# Altium schematic sheet Sheet1.SchDoc
size A3
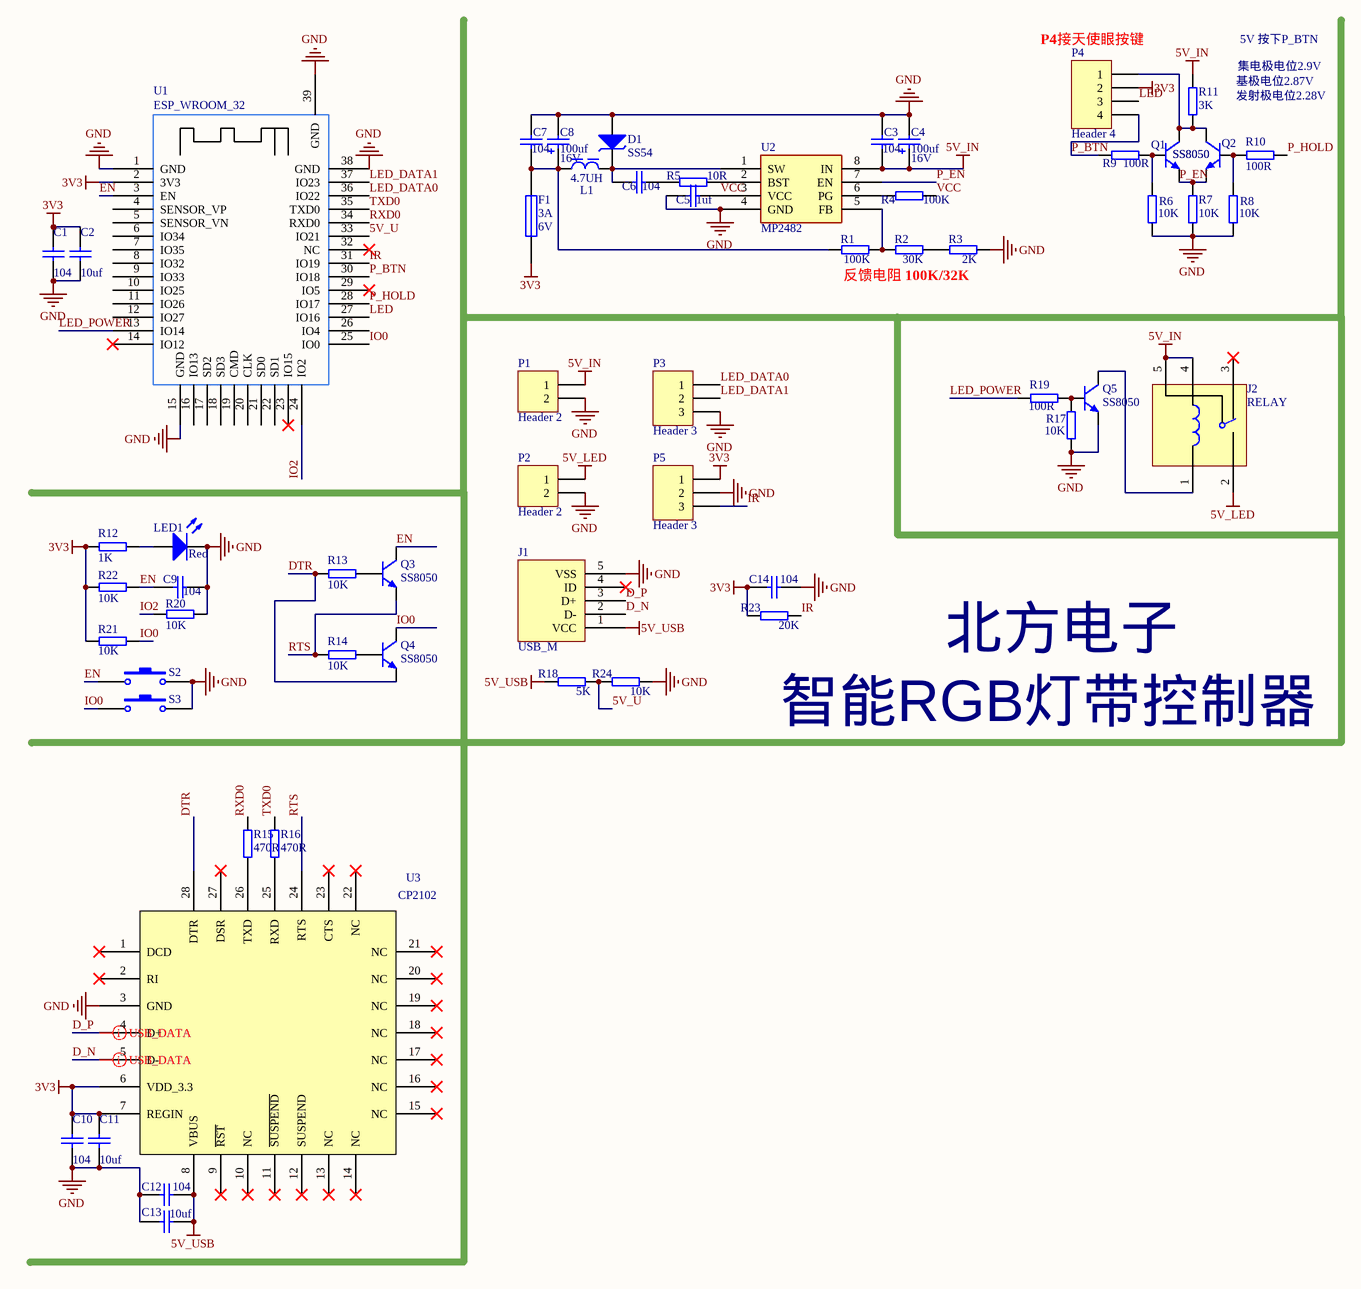
[diagram p0: Sheet1.SchDoc]

## Parts
C1  104  [CAPC1005[0402]S]
C2  10uf  [CAPC1005[0402]S]
C3  104  [CAPC1005[0402]S]
C4  Voltage: 16V  [CAPT6032]  (hidden comment: 100uf)
C5  1uf  [CAPC1005[0402]S]
C6  104  [CAPC1005[0402]S]
C7  104  [CAPC1005[0402]S]
C8  Voltage: 16V  [CAPT6032]  (hidden comment: 100uf)
C9  104  [CAPC1005[0402]S]
C10  104  [CAPC1005[0402]S]
C11  10uf  [CAPC1005[0402]S]
C12  104  [CAPC1005[0402]S]
C13  10uf  [CAPC1005[0402]S]
C14  104  [CAPC1005[0402]S]
D1  SS54  [SMA[DO-214AC]]
F1  Imax: 3A  Voltage: 6V  [CAPC4532[1812]S]
J1  USB_M  [1__Micro USB 牛角]
J2  RELAY  [RELAY-HK3FF]
L1  4.7UH  [CD75]
LED1  Red  [LEDC1608(0603)]
P1  Header 2  [DC-5.5mm]
P2  Header 2  [KF142R_2P]
P3  Header 3  [HDR1X3]
P4  Header 4  [HDR1X4]
P5  Header 3  [HDR1X3]
Q1  SS8050  [SOT23]
Q2  SS8050  [SOT23]
Q3  SS8050  [SOT23]
Q4  SS8050  [SOT23]
Q5  SS8050  [SOT23]
R1  100K  [RESC1005[0402]S]
R2  30K  [RESC1005[0402]S]
R3  2K  [RESC1005[0402]S]
R4  100K  [RESC1005[0402]S]
R5  10R  [RESC1005[0402]S]
R6  10K  [RESC1005[0402]S]
R7  10K  [RESC1005[0402]S]
R8  10K  [RESC1005[0402]S]
R9  100R  [RESC1005[0402]S]
R10  100R  [RESC1005[0402]S]
R11  3K  [RESC1005[0402]S]
R12  1K  [RESC1005[0402]S]
R13  10K  [RESC1005[0402]S]
R14  10K  [RESC1005[0402]S]
R15  470R  [RESC1005[0402]S]
R16  470R  [RESC1005[0402]S]
R17  10K  [RESC1005[0402]S]
R18  5K  [RESC1005[0402]S]
R19  100R  [RESC1005[0402]S]
R20  10K  [RESC1005[0402]S]
R21  10K  [RESC1005[0402]S]
R22  10K  [RESC1005[0402]S]
R23  20K  [RESC1005[0402]S]
R24  10K  [RESC1005[0402]S]
S2  SW-PB  [button]  (value not drawn)
S3  SW-PB  [button]  (value not drawn)
U1  ESP_WROOM_32  [ESP32]
U2  MP2482  [SOIC-8]
U3  CP2102  [QFN_28]

## Nets
3V3: C1.2 C2.2 C10.2 C11.2 C14.1 F1.1 P4.2 P5.1 R12.1 R21.1 R22.1 R23.2 U1.2(3V3) U3.6(VDD_3.3) U3.7(REGIN)
5V_IN: C3.1 C4.1 J2.4 J2.5 P1.1 R11.1 U2.8(IN)
5V_LED: J2.2 P2.1
5V_USB: C12.2 C13.2 J1.1(VCC) R18.2 U3.8(VBUS)
GND: C1.1 C2.1 C3.2 C4.2 C5.2 C7.2 C8.2 C9.1 C10.1 C11.1 C12.1 C13.1 C14.2 D1.A J1.5(VSS) LED1.C P1.2 P2.2 P3.3 P5.2 Q5.2(E) R3.1 R6.1 R7.1 R8.1 R17.2 R20.2 R24.1 S2.2 S3.2 U1.1(GND) U1.15(GND) U1.38(GND) U1.39(GND) U2.4(GND) U3.3(GND)
5V_U: R18.1 R24.2 U1.33(IO21)
D_N: J1.2(D-) U3.5(D-)
D_P: J1.3(D+) U3.4(D+)
DTR: Q4.2(E) R13.2 U3.28(DTR)
EN: C9.2 Q3.3(C) R22.2 S2.1 U1.3(EN)
IO0: Q4.3(C) R21.2 S3.1 U1.25(IO0)
IO2: R20.1 U1.24(IO2)
IR: P5.3 R23.1 U1.31(IO19)
LED: P4.3 U1.27(IO16)
LED_DATA0: P3.1 U1.36(IO22)
LED_DATA1: P3.2 U1.37(IO23)
LED_POWER: R19.1 U1.13(IO14)
P_BTN: P4.4 R9.2 U1.30(IO18)
P_EN: Q1.2(E) Q2.2(E) R7.2 U2.7(EN)
P_HOLD: R10.1 U1.28(IO17)
RTS: Q3.2(E) R14.2 U3.24(RTS)
RXD0: R15.1 U1.34(RXD0)
TXD0: R16.1 U1.35(TXD0)
VCC: C5.1 R4.1 U2.3(VCC)
NetC6_1: C6.1 R5.2
NetC6_2: C6.2 D1.K L1.2 U2.1(SW)
NetC7_1: C7.1 C8.1 F1.2 L1.1 R1.2
NetJ2_1: J2.1 Q5.3(C)
NetLED1_A: LED1.A R12.2
NetP4_1: P4.1 Q1.3(C) Q2.3(C) R11.2
NetQ1_1: Q1.1(B) R6.2 R9.1
NetQ2_1: Q2.1(B) R8.2 R10.2
NetQ3_1: Q3.1(B) R13.1
NetQ4_1: Q4.1(B) R14.1
NetQ5_1: Q5.1(B) R17.1 R19.2
NetR1_1: R1.1 R2.2 U2.5(FB)
NetR2_1: R2.1 R3.2
NetR4_2: R4.2 U2.6(PG)
NetR5_1: R5.1 U2.2(BST)
NetR15_2: R15.2 U3.26(TXD)
NetR16_2: R16.2 U3.25(RXD)

Not connected (* = marked no-connect by the designer): J1 4(ID)*; J2 3*; U1 4(SENSOR_VP) 5(SENSOR_VN) 6(IO34) 7(IO35) 8(IO32) 9(IO33) 10(IO25) 11(IO26) 12(IO27) 14(IO12)* 16(IO13) 17(SD2) 18(SD3) 19(CMD) 20(CLK) 21(SD0) 22(SD1) 23(IO15)* 26(IO4) 29(IO5)* 32(NC)*; U3 1(DCD)* 2(RI)* 9(~{RST})* 10(NC)* 11(~{SUSPEND})* 12(SUSPEND)* 13(NC)* 14(NC)* 15(NC)* 16(NC)* 17(NC)* 18(NC)* 19(NC)* 20(NC)* 21(NC)* 22(NC)* 23(CTS)* 27(DSR)*

## Layout directives
differential pair: D_N, D_P

## Notes on the sheet
- (near P4) P4接天使眼按键
- 基极电位2.87V
- 发射极电位2.28V
- 集电极电位2.9V
- 5V 按下P_BTN
- 反馈电阻 100K/32K
- 北方电子
- 智能RGB灯带控制器

## Library data of the parts
C1-C3 C5-C7 C9-C14 = Cap Chip 2: Chip Capacitor, Silkscreen Border; Voltage: 63V; Tolerance: Y5V; Published: 8-Jun-2000; Revision: July-2002: Re-released for DXP Platform.; Publisher: Altium Limited; Price(RMB): 0.000
  C1 C3 C6 C7 C9 C10 C12 C14: Value: 104
  C2 C11 C13: Value: 10uf
  C5: Value: 1uf
C4 C8 = Cap Tan: Molded (Tantalum) Capacitor, 2-Leads,; Published: 8-Jun-2000; Revision: July-2002: Re-released for DXP Platform.; Publisher: Altium Limited; Price(RMB): 0.000; Value: 100uf
D1 = Diode TVS Uni-Dir: TRANSIENT VOLTAGE  SUPPRESSOR DIODE; Imax: 500mA; Published: 8-Jun-2000; Publisher: Altium Limited; Price(RMB): 0.000; PartNumber: SS54
F1 = Fuse Chip: Fuse; Published: 8-Jun-2000; Revision: July-2002: Re-released for DXP Platform.; Publisher: Altium Limited; Price(RMB): 0.000
J1 = USB_M: MicroUSB接口
J2 = RELAY-HK3FF: 单刀双掷继电器
L1 = Ind Power: Power Inductor, Ferrite-Core; Imax: 50mA; DCR: .5m; Published: 8-Jun-2000; Revision: July-2002: Re-released for DXP Platform.; Publisher: Altium Limited; Price(RMB): 0.000; Value: 4.7UH
LED1 = LED Chip: Typical Chip LED; Published: 8-Jun-2000; Revision: July-2002: Re-released for DXP Platform.; Publisher: Altium Limited; Price(RMB): 0.00; Color: Red
P1 P2 = Header 2: Header, 2-Pin; LatestRevisionDate: 17-Jul-2002; LatestRevisionNote: Re-released for DXP Platform.; Publisher: Altium Limited; Price(RMB): 0.00
P3 P5 = Header 3: Header, 3-Pin; LatestRevisionDate: 17-Jul-2002; LatestRevisionNote: Re-released for DXP Platform.; Publisher: Altium Limited; Price(RMB): 0.00
P4 = Header 4: Header, 4-Pin; LatestRevisionDate: 17-Jul-2002; LatestRevisionNote: Re-released for DXP Platform.; Publisher: Altium Limited; Price(RMB): 0.00
Q1-Q5 = NPN SMC SOT-23: NPN Bipolar Transistor; Published: 8-Jun-2000; Revision: July-2002: Re-released for DXP Platform.; Publisher: Altium Limited; Price(RMB): 0.000; PartNumber: SS8050
R1-R24 = Res Chip 2p 2: Chip Resistor, Border Silkscreen On PCB Library; Tolerance: 5%; Published: 8-Jun-2000; Revision: July-2002: Re-released for DXP Platform.; Publisher: Altium Limited; Price(RMB): 0.000
  R1 R4: Value: 100K
  R2: Value: 30K
  R3: Value: 2K
  R5: Value: 10R
  R6-R8 R13 R14 R17 R20-R22 R24: Value: 10K
  R9 R10 R19: Value: 100R
  R11: Value: 3K
  R12: Value: 1K
  R15 R16: Value: 470R
  R18: Value: 5K
  R23: Value: 20K
S2 S3 = SW-PB: Switch; Published: 24-Mar-1999; Revision: July-2002: Re-released for DXP Platform.; Publisher: Altium Limited; Price(RMB): 0.000